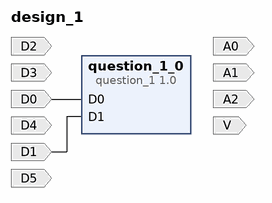
[diagram p0: block diagram of the top level]
# Vivado block design design_1, xc7a35tcpg236-1, Vivado 2023.1
create_bd_design design_1

create_bd_port -dir I D0
create_bd_port -dir I D1
create_bd_port -dir I D2
create_bd_port -dir I D3
create_bd_port -dir I D4
create_bd_port -dir I D5
create_bd_port -dir O V
create_bd_port -dir O A0
create_bd_port -dir O A1
create_bd_port -dir O A2

create_bd_cell -type ip -vlnv xilinx.com:user:question_1:1.0 question_1_0

# ---- connections ----

connect_bd_net -net D0_1 [get_bd_ports D0] [get_bd_pins question_1_0/D0]
connect_bd_net -net D1_1 [get_bd_ports D1] [get_bd_pins question_1_0/D1]

validate_bd_design
save_bd_design
